# EAGLE schematic robot7 (EAGLE 7.7.0)
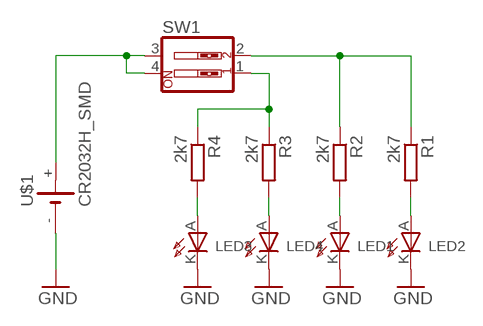
[diagram p0: schematic, sheet 1]

## Parts
LED1  LEDREAR  [3MM_REAR]
LED2  LEDREAR  [3MM_REAR]
LED3  LED3MMH  [3MM_H]
LED4  LED3MMH  [3MM_H]
R1  2k7  R-EU_0204/7  [0204/7]
R2  2k7  R-EU_0204/7  [0204/7]
R3  2k7  R-EU_0204/7  [0204/7]
R4  2k7  R-EU_0204/7  [0204/7]
SW1  SW_DIP-2  [EDG-02]
U$1  CR2032H_SMD  [CR2032H_SMD]

## Nets
GND: LED1.K LED2.K LED3.K LED4.K U$1.-
N$21: LED4.A R3.2
N$22: LED3.A R4.2
N$27: R1.1 R2.1 SW1.2
N$28: R3.1 R4.1 SW1.1
N$29: SW1.3 SW1.4 U$1.+
N$30: LED1.A R2.2
N$31: LED2.A R1.2

## Library data of the parts
LED1-LED4 = HA_LED_6:LED
R1-R4 = rcl:R-EU_: RESISTOR, European symbol; SPICEPREFIX: R
SW1 = special:SW_DIP-2: DIP SWITCH
U$1 = battery:CR2032H_SMD